# EAGLE design CC40_RAM_Cart (EAGLE 7.7.0)
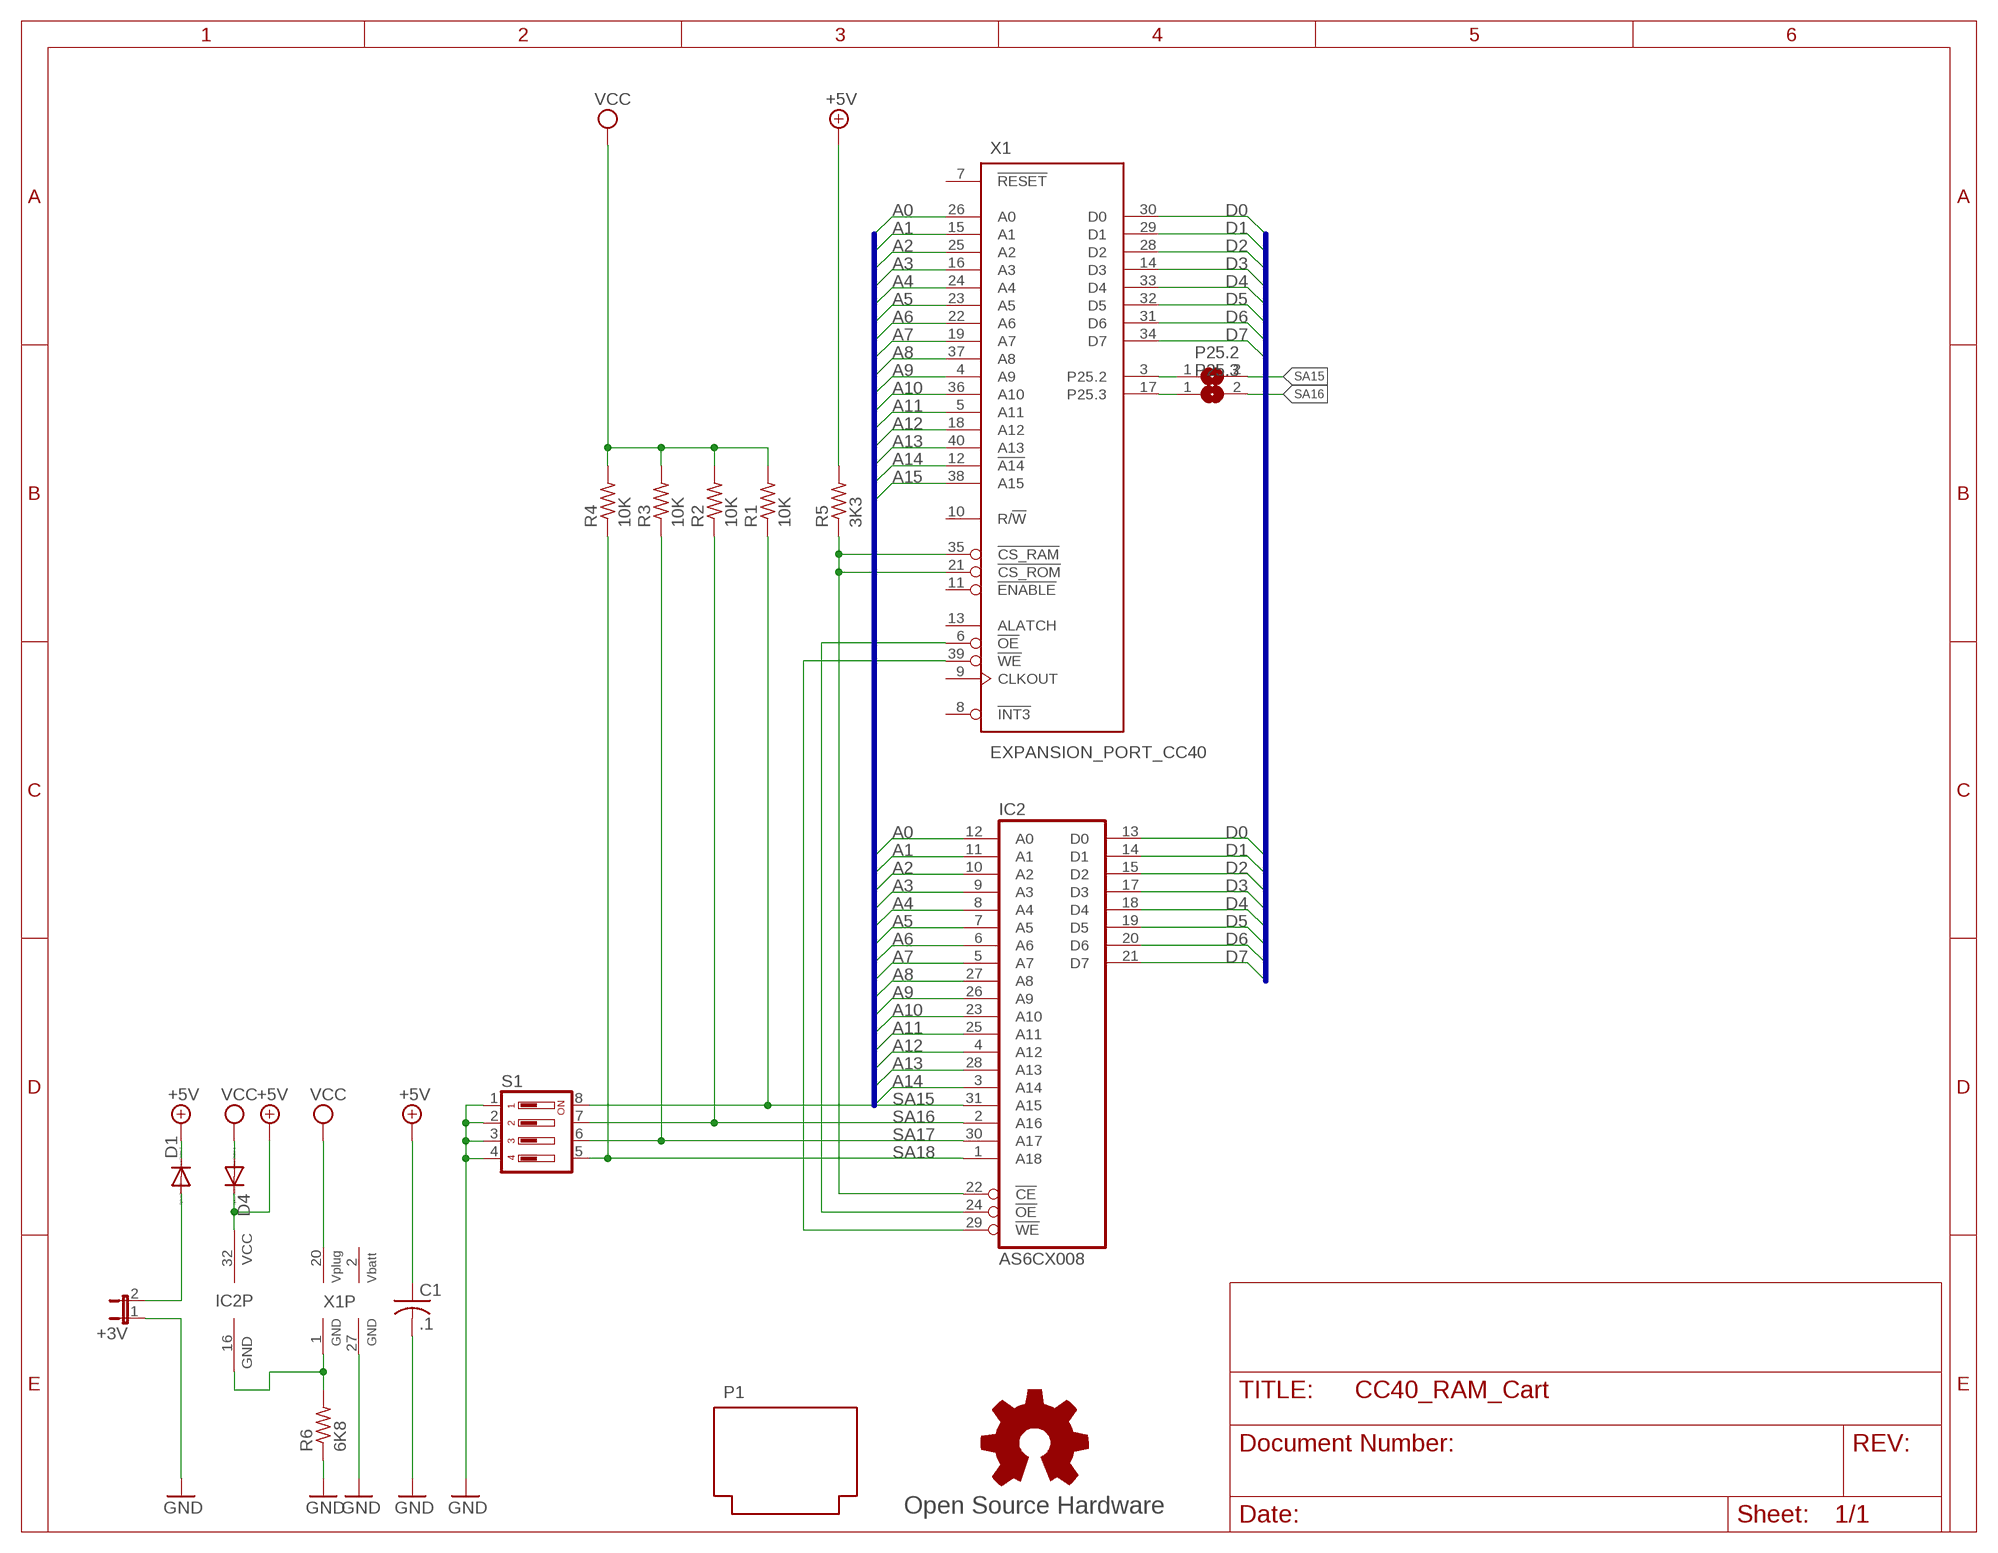
[diagram p0: schematic, sheet 1]

## Parts
+3V  JP1E  [JP1]
C1  .1  C-US025-025X050  [C025-025X050]
D1  DIODE-D-5  [D-5]
D4  DIODE-D-5  [D-5]
GOLD_ORB_SM1  Open Source Hardware  OSHWLOGOLOGO8MM  [OSHW_8MM]
IC2  AS6CX008  AS6C4008PCNR  [DIL32-RP]
P1  CC40_CARTN  [CC40_CART_NOHOLE]
P25.2  SJ  [SJ]
P25.3  SJ  [SJ]
R1  10K  R-US_0204/7  [0204/7]
R2  10K  R-US_0204/7  [0204/7]
R3  10K  R-US_0204/7  [0204/7]
R4  10K  R-US_0204/7  [0204/7]
R5  3K3  R-US_0204/7  [0204/7]
R6  6K8  R-US_0204/7  [0204/7]
S1  DP04  [DP-04]
X1  EXPANSION_PORT_CC40  [MA20-2(.050)]

## Nets
!OE: IC2.24(!OE) X1.6(!OE)
!WE: IC2.29(!WE) X1.39(!WE)
+5V: C1.1 D1.C D4.C IC2.32(VCC) R5.2
A0: IC2.12(A0) X1.26(A0)
A1: IC2.11(A1) X1.15(A1)
A2: IC2.10(A2) X1.25(A2)
A3: IC2.9(A3) X1.16(A3)
A4: IC2.8(A4) X1.24(A4)
A5: IC2.7(A5) X1.23(A5)
A6: IC2.6(A6) X1.22(A6)
A7: IC2.5(A7) X1.19(A7)
A8: IC2.27(A8) X1.37(A8)
A9: IC2.26(A9) X1.4(A9)
A10: IC2.23(A10) X1.36(A10)
A11: IC2.25(A11) X1.5(A11)
A12: IC2.4(A12) X1.18(A12)
A13: IC2.28(A13) X1.40(A13)
A14: IC2.3(A14) X1.12(!A14)
A15: X1.38(A15)
D0: IC2.13(D0) X1.30(D0)
D1: IC2.14(D1) X1.29(D1)
D2: IC2.15(D2) X1.28(D2)
D3: IC2.17(D3) X1.14(D3)
D4: IC2.18(D4) X1.33(D4)
D5: IC2.19(D5) X1.32(D5)
D6: IC2.20(D6) X1.31(D6)
D7: IC2.21(D7) X1.34(D7)
GND: +3V.1 C1.2 R6.1 S1.1 S1.2 S1.3 S1.4 X1.27(GND)
N$1: IC2.22(!CE) R5.1 X1.21(!CS_ROM) X1.35(!CS_RAM)
N$6: +3V.2 D1.A
N$7: IC2.16(GND) R6.2 X1.1(GND)
P25.2: P25.2.1 X1.3(P25.2)
P25.3: P25.3.1 X1.17(P25.3)
SA15: IC2.31(A15) P25.2.2 R1.1 S1.8
SA16: IC2.2(A16) P25.3.2 R2.1 S1.7
SA17: IC2.30(A17) R3.1 S1.6
SA18: IC2.1(A18) R4.1 S1.5
VCC: D4.A R1.2 R2.2 R3.2 R4.2 X1.20(VPLUG)
Unconnected: X1.7(!RESET) X1.8(!INT3) X1.9(CLKOUT) X1.10(R/!W) X1.11(!ENABLE) X1.13(ALATCH)

## Buses
A[0..15]
D[0..7]

## Power pins joined to a net without a drawn wire
VBATT: X1.2(VBATT)

## Library data of the parts
+3V = jumper:JP1E: JUMPER
C1 = rcl:C-US: CAPACITOR, American symbol
D1 D4 = diode:DIODE-: DIODE
GOLD_ORB_SM1 = oshw:OSHWLOGO: The OSHW logo for PCB layout
IC2 = memory-alliance:AS6C4008
P1 = ti-cc40-74-95:CC40_CART
P25.2 P25.3 = jumper:SJ: SMD solder JUMPER
R1-R6 = rcl:R-US_: RESISTOR, American symbol
S1 = switch-dil-rp:DP04: DIL/CODE SWITCH; MPN: DP04; OC_FARNELL: 9471600; OC_NEWARK: 73J0027
X1 = ti-cc40-74-95:EXPANSION_PORT_CC40

## Board
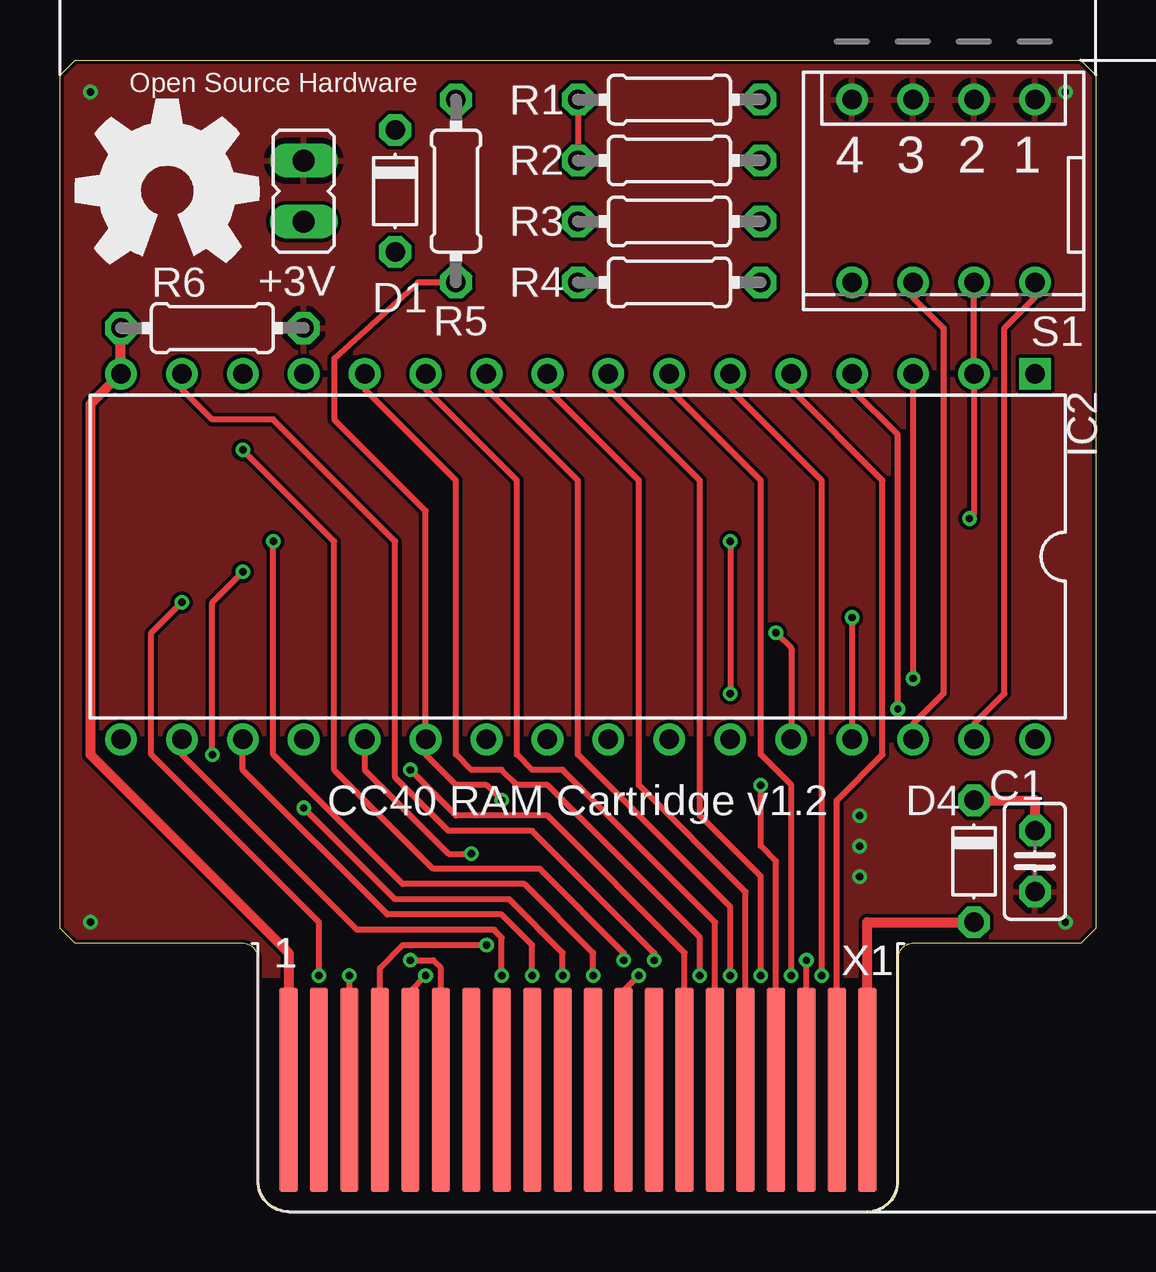
[diagram p1: board, top side]
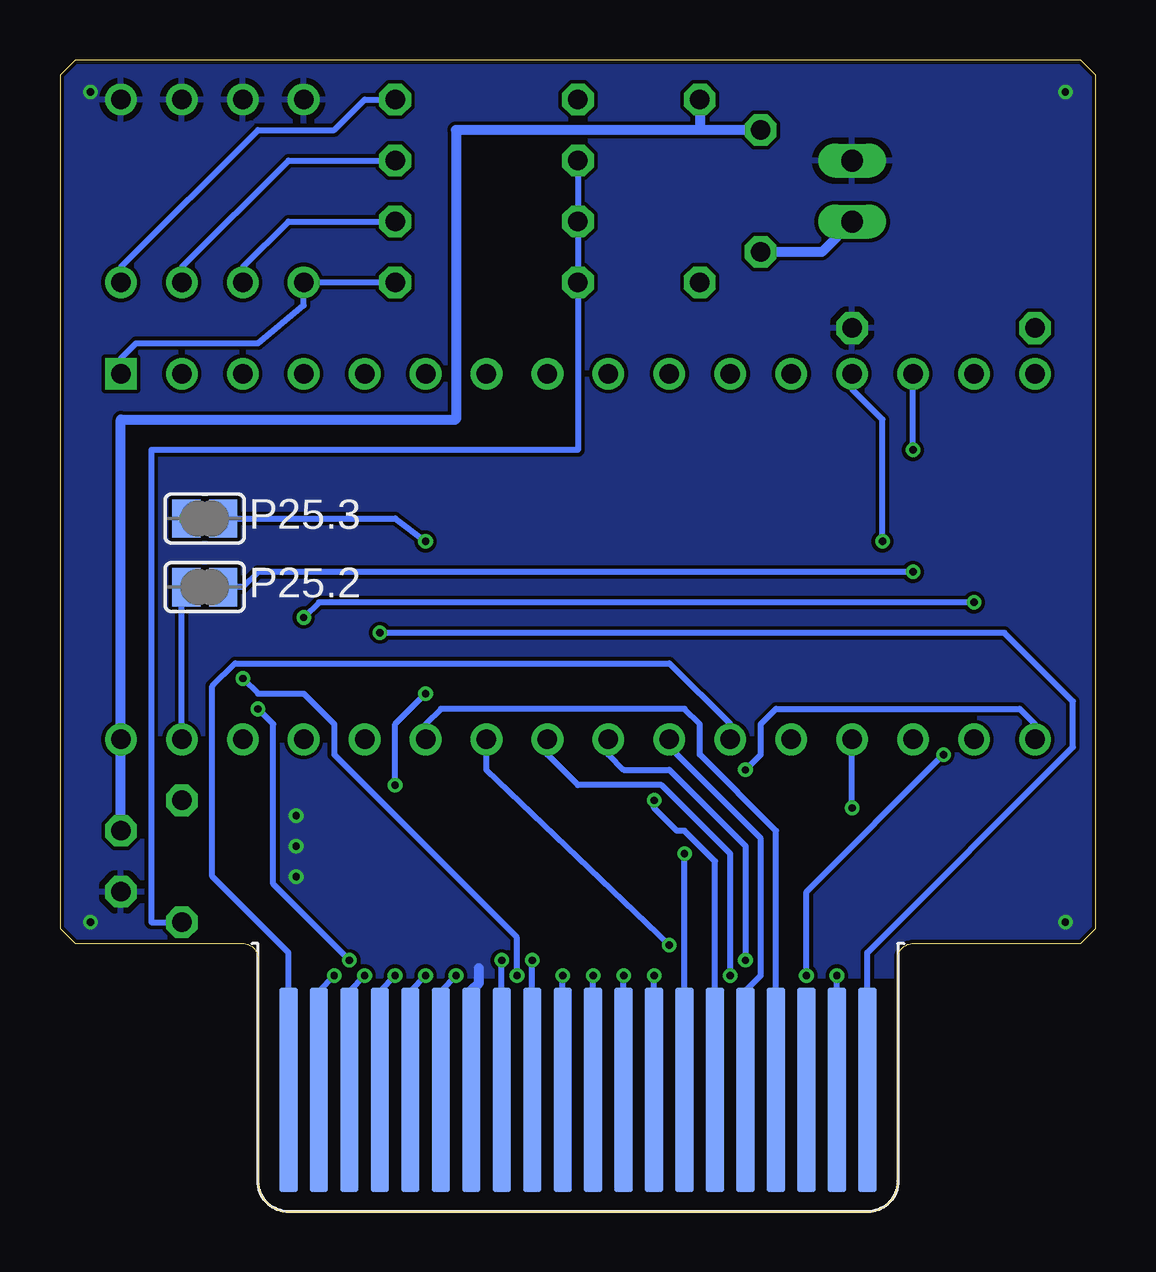
[diagram p2: board, bottom side, seen from below]

Size 43.18 x 48.01 mm. Coordinates in mm from the lower left corner, seen from the top.
Outline: 8.25,1.27 8.25,10.54 arc90 7.62,11.18 0.64,11.18 0,11.81 0,47.37 0.64,48.01 42.55,48.01 43.18,47.37 43.18,11.81 42.55,11.18 35.56,11.18 arc90 34.92,10.54 34.92,1.27 arc-90 33.66,0 9.53,0 arc-90 8.25,1.27
Copper layers (1*16): Top 0.035mm / dielectric 1.5mm / Bottom 0.035mm
Design rules "hackvana": minimum track width 6mil, minimum drill 0.3mm, track to track 6mil, track to pad 6mil, pad to pad 6mil, via to via 6mil, smd to smd 0mil, copper to edge 6mil, drill to drill 6mil, minimum pad ring 10mil, minimum via ring 6mil, stop-mask expansion 2mil, vias tented up to drill 100mil, thermal gap 10mil

### Footprints (pad centres in the part's own frame; a part is rotated, then mirrored left to right if it is on the bottom)
JP1 = drill 0.914 long: 1 0,-1.27; 2 0,1.27
C025-025X050 = drill 0.813 octagon: 1 -1.27,0; 2 1.27,0
D-5 = drill 0.813 octagon: A 2.54,0; C -2.54,0
DIL32-RP = drill 0.813 square: 1 -19.05,-7.62 | drill 0.813: 2 -16.51,-7.62; 3 -13.97,-7.62; 4 -11.43,-7.62; 5 -8.89,-7.62; 6 -6.35,-7.62; 7 -3.81,-7.62; 8 -1.27,-7.62; 9 1.27,-7.62; 10 3.81,-7.62; 11 6.35,-7.62; 12 8.89,-7.62; 13 11.43,-7.62; 14 13.97,-7.62; 15 16.51,-7.62; 16 19.05,-7.62; 17 19.05,7.62; 18 16.51,7.62; 19 13.97,7.62; 20 11.43,7.62; 21 8.89,7.62; 22 6.35,7.62; 23 3.81,7.62; 24 1.27,7.62; 25 -1.27,7.62; 26 -3.81,7.62; 27 -6.35,7.62; 28 -8.89,7.62; 29 -11.43,7.62; 30 -13.97,7.62; 31 -16.51,7.62; 32 -19.05,7.62
SJ = smd 1.168 x 1.6: 1 -0.762,0; 2 0.762,0
0204/7 = drill 0.813 octagon: 1 -3.81,0; 2 3.81,0
DP-04 = drill 0.813: 1 -3.81,-3.81; 2 -1.27,-3.81; 3 1.27,-3.81; 4 3.81,-3.81; 5 3.81,3.81; 6 1.27,3.81; 7 -1.27,3.81; 8 -3.81,3.81
MA20-2(.050) = smd 0.762 x 8.534: 1 -12.065,0; 2 -10.795,0; 3 -9.525,0; 4 -8.255,0; 5 -6.985,0; 6 -5.715,0; 7 -4.445,0; 8 -3.175,0; 9 -1.905,0; 10 -0.635,0; 11 0.635,0; 12 1.905,0; 13 3.175,0; 14 4.445,0; 15 5.715,0; 16 6.985,0; 17 8.255,0; 18 9.525,0; 19 10.795,0; 20 12.065,0 | smd 0.762 x 8.534 bottom: 21 12.065,0; 22 10.795,0; 23 9.525,0; 24 8.255,0; 25 6.985,0; 26 5.715,0; 27 4.445,0; 28 3.175,0; 29 1.905,0; 30 0.635,0; 31 -0.635,0; 32 -1.905,0; 33 -3.175,0; 34 -4.445,0; 35 -5.715,0; 36 -6.985,0; 37 -8.255,0; 38 -9.525,0; 39 -10.795,0; 40 -12.065,0

### Placement (x,y rotation side)
+3V  10.16,42.55 180 top
C1  40.64,14.61 270 top
D1  13.97,42.55 270 top
D4  38.1,14.61 270 top
GOLD_ORB_SM1  4.45,42.55 0 top
IC2  21.59,27.3 180 top
P1  21.59,0 0 top
P25.2  37.15,26.04 180 bottom
P25.3  37.15,28.89 180 bottom
R1  25.4,46.35 180 top
R2  25.4,43.81 180 top
R3  25.4,41.27 180 top
R4  25.4,38.73 180 top
R5  16.51,42.55 90 top
R6  6.35,36.83 180 top
S1  36.83,42.55 180 top
X1  21.59,5.08 0 top

### Tracks (layer width: path | path; a pad name or v marks a point on that pad's centre or on a via)
!OE  (via drill 0.3)
  Top 0.254: X1.6 15.88,10.16 15.56,10.48 v14.61,10.48
  Bottom 0.254: IC2.24 20.32,19.05 19.68,18.41 17.78,18.41 14.61,15.24 v14.61,10.48
!WE  (via drill 0.3)
  Top 0.254: v10.79,9.84 10.79,12.06 3.81,19.05 3.81,24.13 v5.08,25.4 | v33.02,24.77 IC2.29
  Bottom 0.254: X1.39 v10.79,9.84 | v5.08,25.4 32.38,25.4 v33.02,24.77
+5V
  Top 0.406: D4.C 40.64,17.14 C1.1
  Bottom 0.406: C1.1 IC2.32 40.64,33.02 26.67,33.02 26.67,45.09 16.51,45.09 | R5.2 16.51,45.09 | D1.C 16.51,45.09
A0  (via drill 0.3)
  Top 0.254: v26.67,9.84 26.67,11.43 20.32,17.78 19.05,17.78 18.41,18.41 17.14,18.41 16.51,19.05 16.51,30.48 12.7,34.29 IC2.12
  Bottom 0.254: X1.26 27.3,9.21 v26.67,9.84
A1
  Top 0.254: X1.15 27.3,12.06 20.95,18.41 19.68,18.41 19.05,19.05 19.05,30.48 15.24,34.29 IC2.11
A2  (via drill 0.3)
  Top 0.254: v27.94,9.84 27.94,12.7 21.59,19.05 21.59,30.48 17.78,34.29 IC2.10
  Bottom 0.254: X1.25 28.57,9.21 v27.94,9.84
A3
  Top 0.254: X1.16 28.57,13.34 24.13,17.78 24.13,30.48 20.32,34.29 IC2.9
A4  (via drill 0.3)
  Top 0.254: v29.21,9.84 29.21,13.97 26.67,16.51 26.67,30.48 22.86,34.29 IC2.8
  Bottom 0.254: X1.24 29.84,9.21 v29.21,9.84
A5  (via drill 0.3)
  Top 0.254: v30.48,9.84 30.48,17.78 29.21,19.05 29.21,30.48 25.4,34.29 IC2.7
  Bottom 0.254: X1.23 31.12,9.21 v30.48,9.84
A6  (via drill 0.3)
  Top 0.254: v31.75,9.84 31.75,30.48 27.94,34.29 IC2.6
  Bottom 0.254: X1.22 32.38,9.21 v31.75,9.84
A7
  Top 0.254: IC2.5 30.48,34.29 34.29,30.48 34.29,19.05 32.38,17.14 X1.19 32.38,4.76
A8
  Bottom 0.254: X1.37 13.33,15.88 16.51,19.05 16.51,20.32 17.14,20.95 27.3,20.95 27.94,20.32 IC2.27
A9  (via drill 0.3)
  Top 0.254: X1.4 13.33,10.16 14.29,11.11 v17.78,11.11
  Bottom 0.254: v17.78,11.11 25.4,18.41 IC2.26
A10
  Bottom 0.254: X1.36 14.61,9.21 13.97,9.84 13.97,15.56 17.78,19.37 IC2.23
A11  (via drill 0.3)
  Top 0.254: X1.5 14.61,9.21 v15.24,9.84
  Bottom 0.254: IC2.25 22.86,19.05 21.59,17.78 18.1,17.78 15.24,14.92 v15.24,9.84
A12  (via drill 0.3)
  Top 0.254: X1.18 v31.12,10.48 | v34.92,20.95 34.92,32.38 33.02,34.29 IC2.4
  Bottom 0.254: v31.12,10.48 34.29,13.65 34.29,20.32 v34.92,20.95
A13  (via drill 0.3)
  Top 0.254: v29.84,24.13 30.48,23.5 IC2.28
  Bottom 0.254: X1.40 9.53,10.79 0.95,19.37 0.95,21.27 3.81,24.13 v29.84,24.13
A14  (via drill 0.3)
  Top 0.254: X1.12 23.5,9.21 v24.13,9.84 | IC2.3 v35.56,22.23
  Bottom 0.254: v24.13,9.84 24.13,11.43 31.75,19.05 31.75,20.32 33.02,21.59 34.92,21.59 v35.56,22.23
D0  (via drill 0.3)
  Top 0.254: v22.23,9.84 22.23,10.79 19.37,13.65 14.29,13.65 8.89,19.05 v8.89,27.94
  Bottom 0.254: X1.30 v22.23,9.84 | v8.89,27.94 8.89,33.02 10.16,34.29 IC2.13
D1  (via drill 0.3)
  Top 0.254: v23.5,10.48 23.5,10.79 20,14.29 15.56,14.29 11.43,18.41 11.43,27.94 v7.62,31.75
  Bottom 0.254: X1.29 v23.5,10.48 | v7.62,31.75 IC2.14
D2  (via drill 0.3)
  Top 0.254: v24.77,10.48 24.77,10.79 19.68,15.88 16.19,15.88 13.97,18.1 13.97,27.94 8.89,33.02 6.35,33.02 5.08,34.29 IC2.15
  Bottom 0.254: X1.28 v24.77,10.48
D3  (via drill 0.3)
  Top 0.254: X1.14 26.04,10.79 20.32,16.51 16.51,16.51 v14.61,18.41
  Bottom 0.254: v14.61,18.41 13.97,19.05 13.97,20.32 13.33,20.95 3.18,20.95 2.54,20.32 IC2.17
D4  (via drill 0.3)
  Top 0.254: v18.41,9.84 18.41,11.43 18.1,11.75 12.38,11.75 5.08,19.05 IC2.18
  Bottom 0.254: X1.33 v18.41,9.84
D5  (via drill 0.3)
  Top 0.254: v19.68,9.84 19.68,11.11 18.41,12.38 13.65,12.38 7.62,18.41 IC2.19
  Bottom 0.254: X1.32 v19.68,9.84
D6  (via drill 0.3)
  Top 0.254: v20.95,9.84 20.95,10.79 18.73,13.02 13.97,13.02 v10.16,16.83
  Bottom 0.254: X1.31 v20.95,9.84 | v10.16,16.83 IC2.20
D7  (via drill 0.3)
  Top 0.254: IC2.21 12.7,18.41 16.19,14.92 v17.14,14.92
  Bottom 0.254: X1.34 v17.14,14.92
GND  (via drill 0.3)
  Bottom 0.406: X1.27 26.04,9.21 25.72,9.53 25.72,10.16
  other vias: 33.34,16.51 33.34,15.24 33.34,13.97 41.91,12.06 41.91,46.67 1.27,46.67 1.27,12.06
  pour Bottom: 8.25,9.84 8.25,10.54 arc90 7.62,11.18 0.64,11.18 0,11.81 0,47.37 0.64,48.01 42.55,48.01 43.18,47.37 43.18,11.81 42.55,11.18 35.56,11.18 arc90 34.92,10.54 34.92,9.84
  pour Top: 8.25,9.84 8.25,10.54 arc90 7.62,11.18 0.64,11.18 0,11.81 0,47.37 0.64,48.01 42.55,48.01 43.18,47.37 43.18,11.81 42.55,11.18 35.56,11.18 arc90 34.92,10.54 34.92,9.84
N$1  (via drill 0.3)
  Top 0.254: R5.1 14.92,38.73 11.43,35.56 11.43,33.02 15.24,29.21 IC2.22 15.24,19.05 16.51,17.78 17.78,17.78 v18.41,17.14
  Bottom 0.254: IC2.22 15.24,20.32 17.78,22.86 35.88,22.86 36.83,21.91 36.83,13.97 33.66,10.79 X1.21 33.66,4.13 | X1.35 15.88,14.61 17.14,15.88 17.46,15.88 18.41,16.83 v18.41,17.14
N$6
  Bottom 0.406: +3V.2 11.43,40.01 D1.A
N$7
  Top 0.406: R6.2 IC2.16 1.27,33.66 1.27,19.05 9.53,10.79 X1.1
P25.2  (via drill 0.3)
  Top 0.254: X1.3 v12.06,9.84 | v6.35,19.05 6.35,25.4 v7.62,26.67
  Bottom 0.254: v12.06,9.84 12.06,13.34 v6.35,19.05 | v7.62,26.67 34.92,26.67 35.56,26.04 P25.2.1
P25.3  (via drill 0.3)
  Top 0.254: X1.17 29.84,14.61 29.21,15.24 v29.21,17.78 | v27.94,27.94 v27.94,21.59
  Bottom 0.254: v29.21,17.78 29.21,20.32 v27.94,21.59 | P25.3.1 29.21,28.89 v27.94,27.94
SA15
  Top 0.254: IC2.31 38.1,20.32 39.37,21.59 39.37,36.83 40.64,38.1 S1.8
  Bottom 0.254: S1.8 40.64,39.37 34.92,45.09 31.75,45.09 30.48,46.35 R1.1 | IC2.31 38.1,26.48 P25.2.2
SA16  (via drill 0.3)
  Top 0.254: S1.7 IC2.2 38.1,29.08 P25.3.2
  Bottom 0.254: S1.7 38.1,39.37 33.66,43.81 R2.1
  other vias: 37.91,28.89
SA17
  Top 0.254: S1.6 35.56,38.1 36.83,36.83 36.83,21.59 35.56,20.32 IC2.30
  Bottom 0.254: S1.6 35.56,39.37 33.66,41.27 R3.1
SA18
  Bottom 0.254: IC2.1 40.64,35.56 40,36.2 34.92,36.2 33.02,37.78 S1.5 R4.1
VCC
  Top 0.254: R1.2 R2.2
  Top 0.406: D4.A 33.66,12.06 X1.20
  Bottom 0.254: R2.2 R3.2 R4.2 21.59,31.75 39.37,31.75 39.37,12.06 D4.A

### Text on the board
tNames: CC40 RAM Cartridge v1.2
tValues: (c) 2017 RETRO Innovations / http://www.go4retro.com